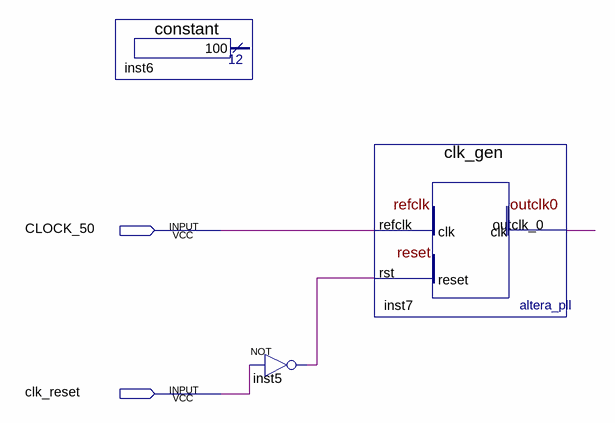
[diagram p0: schematic sheet]
// Quartus schematic Energy_Channel_Sensing.bdf as structural Verilog: 3 symbols, 2 pins
module Energy_Channel_Sensing (
  input  CLOCK_50,
  input  clk_reset
);

  wire inst5_out, inst7_outclk_0;

  constant inst6 ();  // open: result
  not inst5 (inst5_out, clk_reset);
  clk_gen inst7 (.refclk(CLOCK_50), .rst(inst5_out), .outclk_0(inst7_outclk_0));
endmodule
